# Altium schematic sheet WallLightRemote_V1.0_Displays.SchDoc: WallLight Remote
size A4; PageSetup: Record=PageOptions|CenterHorizontal=True|CenterVertical=True|PrintScale=0.97|XCorrection=1.00|YCorrection=1.00|PrintKind=0|BorderSize=5000000|LeftOffset=0|BottomOffset=0|Orientation=2|PaperLength=1000|PaperWidth=1000|Scale=100|PaperSource=7|PrintQuality=-3|MediaType=1|DitherType=10|PrintScaleMode=1|PaperKind=A4|PaperIndex=9; Organization: Crelin; Address1: Karl-Neuhaus-Strasse 6, 2502 Biel; Address2: Florian Baumgartner; Address3: florian.b-h@bluewin.ch; Address4: Tel: (+41) 32-323 56 25 / (+41) 79-502 92 10; DocumentNumber: Displays; Revision: V1.0; SheetNumber: 4; SheetTotal: 5; Author: Florian Baumgartner
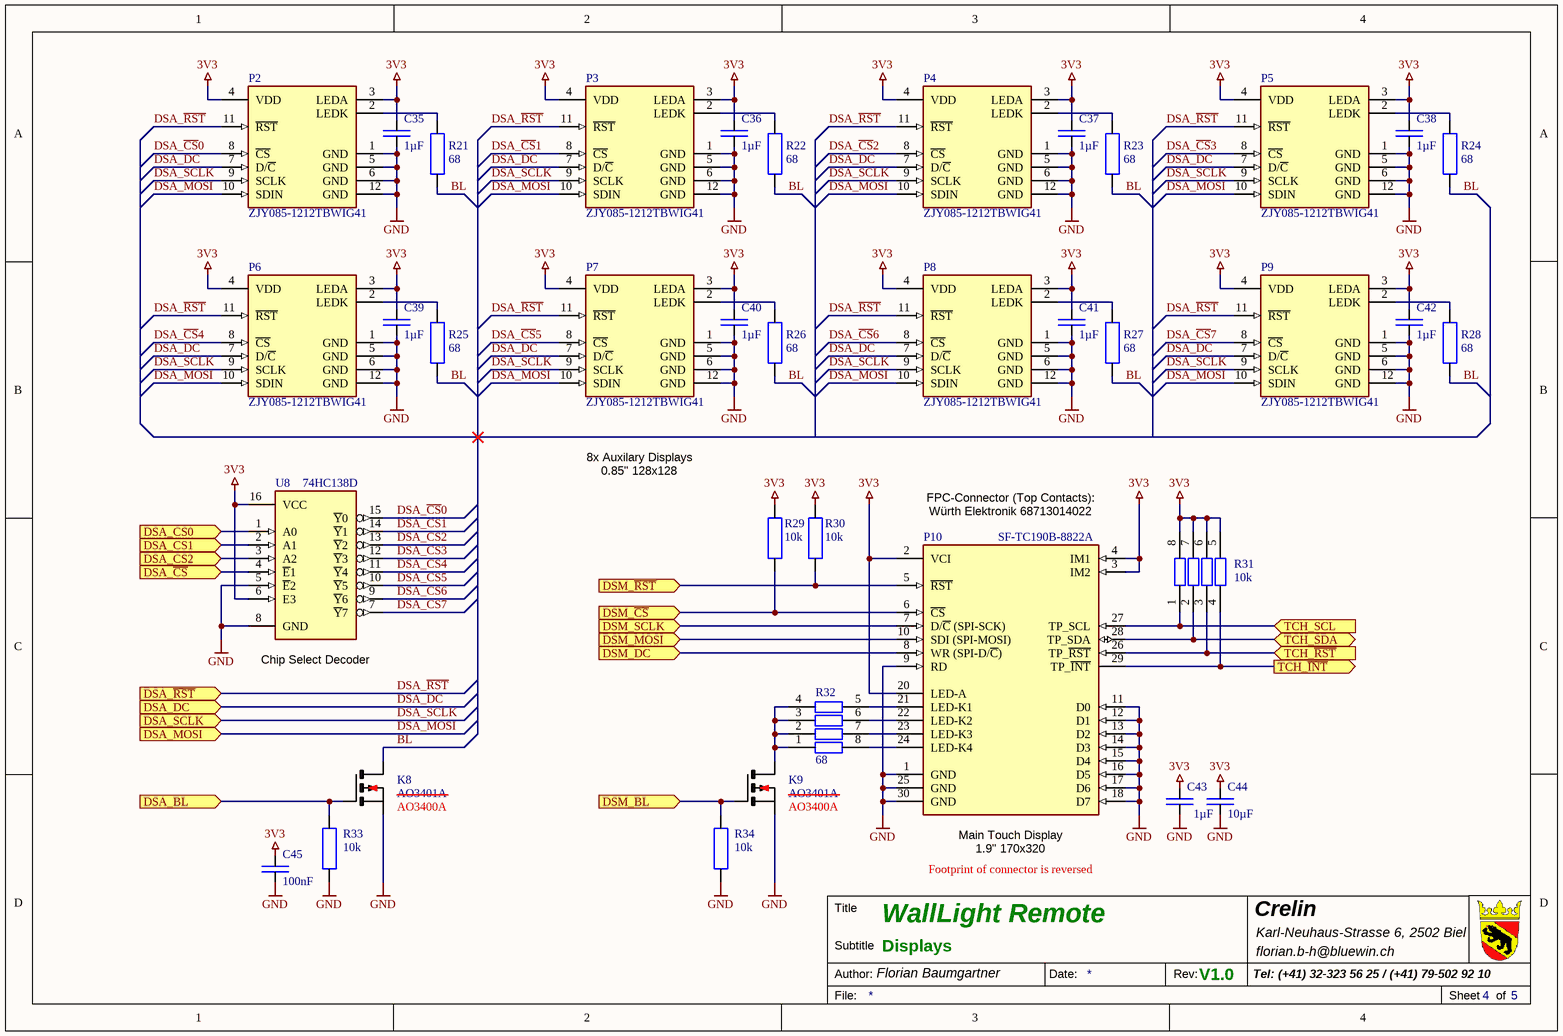
[diagram p0: WallLightRemote_V1.0_Displays.SchDoc]

## Parts
C35  1µF  [SMD Keramikkondensator 0603]
C36  1µF  [SMD Keramikkondensator 0603]
C37  1µF  [SMD Keramikkondensator 0603]
C38  1µF  [SMD Keramikkondensator 0603]
C39  1µF  [SMD Keramikkondensator 0603]
C40  1µF  [SMD Keramikkondensator 0603]
C41  1µF  [SMD Keramikkondensator 0603]
C42  1µF  [SMD Keramikkondensator 0603]
C43  1µF  [SMD Keramikkondensator 0603]
C44  10µF  [SMD Keramikkondensator 1206]
C45  100nF  [SMD Keramikkondensator 0603]
K8  AO3401A  [SMD MOSFET SOT-23]
K9  AO3401A  [SMD MOSFET SOT-23]
P2  ZJY085-1212TBWIG41  [SMD Display 0.85" (N085-1212TBWIG41)]
P3  ZJY085-1212TBWIG41  [SMD Display 0.85" (N085-1212TBWIG41)]
P4  ZJY085-1212TBWIG41  [SMD Display 0.85" (N085-1212TBWIG41)]
P5  ZJY085-1212TBWIG41  [SMD Display 0.85" (N085-1212TBWIG41)]
P6  ZJY085-1212TBWIG41  [SMD Display 0.85" (N085-1212TBWIG41)]
P7  ZJY085-1212TBWIG41  [SMD Display 0.85" (N085-1212TBWIG41)]
P8  ZJY085-1212TBWIG41  [SMD Display 0.85" (N085-1212TBWIG41)]
P9  ZJY085-1212TBWIG41  [SMD Display 0.85" (N085-1212TBWIG41)]
P10  SF-TC190B-8822A  [SMD Display 1.9" (SF-TC190B-8822A)]
R21  68  [SMD Widerstand 0603]
R22  68  [SMD Widerstand 0603]
R23  68  [SMD Widerstand 0603]
R24  68  [SMD Widerstand 0603]
R25  68  [SMD Widerstand 0603]
R26  68  [SMD Widerstand 0603]
R27  68  [SMD Widerstand 0603]
R28  68  [SMD Widerstand 0603]
R29  10k  [SMD Widerstand 0603]
R30  10k  [SMD Widerstand 0603]
R31  10k  [SMD Widerstand Array 4-Fach 0603]
R32  68  [SMD Widerstand Array 4-Fach 0603]
R33  10k  [SMD Widerstand 0603]
R34  10k  [SMD Widerstand 0603]
U8  74HC138D  [SMD IC SOIC-16]

## Ports
DSA_BL (in), DSA_CS0 (in), DSA_CS1 (in), DSA_CS2 (in), DSA_DC (in), DSA_MOSI (in), DSA_SCLK (in), DSA_~{CS} (in), DSA_~{RST} (in), DSM_BL (in), DSM_DC (in), DSM_MOSI (in), DSM_SCLK (in), DSM_~{CS} (in), DSM_~{RST} (in), TCH_SCL (in), TCH_SDA (bidir), TCH_~{INT} (out), TCH_~{RST} (in)

## Nets
3V3: C35.2 C36.2 C37.2 C38.2 C39.2 C40.2 C41.2 C42.2 C43.2 C44.2 C45.2 P2.3(LEDA) P2.4(VDD) P3.3(LEDA) P3.4(VDD) P4.3(LEDA) P4.4(VDD) P5.3(LEDA) P5.4(VDD) P6.3(LEDA) P6.4(VDD) P7.3(LEDA) P7.4(VDD) P8.3(LEDA) P8.4(VDD) P9.3(LEDA) P9.4(VDD) P10.2(VCI) P10.3(IM2) P10.4(IM1) P10.20(LED-A) R29.2 R30.2 R31.5 R31.6 R31.7 R31.8 U8.6(E3) U8.16(VCC)
GND: C35.1 C36.1 C37.1 C38.1 C39.1 C40.1 C41.1 C42.1 C43.1 C44.1 C45.1 K8.S K9.S P2.1(GND) P2.5(GND) P2.6(GND) P2.12(GND) P3.1(GND) P3.5(GND) P3.6(GND) P3.12(GND) P4.1(GND) P4.5(GND) P4.6(GND) P4.12(GND) P5.1(GND) P5.5(GND) P5.6(GND) P5.12(GND) P6.1(GND) P6.5(GND) P6.6(GND) P6.12(GND) P7.1(GND) P7.5(GND) P7.6(GND) P7.12(GND) P8.1(GND) P8.5(GND) P8.6(GND) P8.12(GND) P9.1(GND) P9.5(GND) P9.6(GND) P9.12(GND) P10.1(GND) P10.9(RD) P10.11(D0) P10.12(D1) P10.13(D2) P10.14(D3) P10.15(D4) P10.16(D5) P10.17(D6) P10.18(D7) P10.25(GND) P10.30(GND) R33.1 R34.1 U8.5(~{E}2) U8.8(GND)
BL: K8.D R21.2 R22.2 R23.2 R24.2 R25.2 R26.2 R27.2 R28.2
DSA_BL: K8.G R33.2 ; port DSA_BL
DSA_~{CS}: U8.4(~{E}1) ; port DSA_~{CS}
DSA_~{CS}0: P2.8(~{CS}) U8.15(~{Y}0)
DSA_~{CS}1: P3.8(~{CS}) U8.14(~{Y}1)
DSA_~{CS}2: P4.8(~{CS}) U8.13(~{Y}2)
DSA_~{CS}3: P5.8(~{CS}) U8.12(~{Y}3)
DSA_~{CS}4: P6.8(~{CS}) U8.11(~{Y}4)
DSA_~{CS}5: P7.8(~{CS}) U8.10(~{Y}5)
DSA_~{CS}6: P8.8(~{CS}) U8.9(~{Y}6)
DSA_~{CS}7: P9.8(~{CS}) U8.7(~{Y}7)
DSA_CS0: U8.1(A0) ; port DSA_CS0
DSA_CS1: U8.2(A1) ; port DSA_CS1
DSA_CS2: U8.3(A2) ; port DSA_CS2
DSA_DC: P2.7(D/~{C}) P3.7(D/~{C}) P4.7(D/~{C}) P5.7(D/~{C}) P6.7(D/~{C}) P7.7(D/~{C}) P8.7(D/~{C}) P9.7(D/~{C}) ; port DSA_DC
DSA_MOSI: P2.10(SDIN) P3.10(SDIN) P4.10(SDIN) P5.10(SDIN) P6.10(SDIN) P7.10(SDIN) P8.10(SDIN) P9.10(SDIN) ; port DSA_MOSI
DSA_~{RST}: P2.11(~{RST}) P3.11(~{RST}) P4.11(~{RST}) P5.11(~{RST}) P6.11(~{RST}) P7.11(~{RST}) P8.11(~{RST}) P9.11(~{RST}) ; port DSA_~{RST}
DSA_SCLK: P2.9(SCLK) P3.9(SCLK) P4.9(SCLK) P5.9(SCLK) P6.9(SCLK) P7.9(SCLK) P8.9(SCLK) P9.9(SCLK) ; port DSA_SCLK
DSM_BL: K9.G R34.2 ; port DSM_BL
DSM_~{CS}: P10.6(~{CS}) R29.1 ; port DSM_~{CS}
DSM_DC: P10.8(WR_(SPI-D/~{C})) ; port DSM_DC
DSM_MOSI: P10.10(SDI_(SPI-MOSI)) ; port DSM_MOSI
DSM_~{RST}: P10.5(~{RST}) R30.1 ; port DSM_~{RST}
DSM_SCLK: P10.7(D/~{C}_(SPI-SCK)) ; port DSM_SCLK
TCH_~{INT}: P10.29(TP_~{INT}) R31.4 ; port TCH_~{INT}
TCH_~{RST}: P10.26(TP_~{RST}) R31.3 ; port TCH_~{RST}
TCH_SCL: P10.27(TP_SCL) R31.1 ; port TCH_SCL
TCH_SDA: P10.28(TP_SDA) R31.2 ; port TCH_SDA
NetK9_D: K9.D R32.1 R32.2 R32.3 R32.4
NetP2_2: P2.2(LEDK) R21.1
NetP3_2: P3.2(LEDK) R22.1
NetP4_2: P4.2(LEDK) R23.1
NetP5_2: P5.2(LEDK) R24.1
NetP6_2: P6.2(LEDK) R25.1
NetP7_2: P7.2(LEDK) R26.1
NetP8_2: P8.2(LEDK) R27.1
NetP9_2: P9.2(LEDK) R28.1
NetP10_21: P10.21(LED-K1) R32.5
NetP10_22: P10.22(LED-K2) R32.6
NetP10_23: P10.23(LED-K3) R32.7
NetP10_24: P10.24(LED-K4) R32.8

Not connected (* = marked no-connect by the designer): P10 19(NC)

## Notes on the sheet
- 8x Auxilary Displays
- 0.85" 128x128
- FPC-Connector (Top Contacts):
- (near P10) Würth Elektronik 68713014022
- (near U8) Chip Select Decoder
- (near K8) AO3400A
- (near K9) AO3400A
- (near P10) Main Touch Display
- (near P10) 1.9" 170x320
- Footprint of connector is reversed
- Title
- Crelin
- Author:
- Subtitle
- Date:
- Rev:
- File:
- Sheet
- of

## Library data of the parts
C35-C43 = C-CAPACITOR: CAP-MK; Component Description: Multilayer Ceramic Capacitors; Component Value: 1µF 50V; Digikey: 1276-1860-1-ND; Farnell: 3013383; Mouser: 187-CL10A105KB8NNNC; JLC-Parts: C15849; Unit Price: 0.01
C44 = E6 - 10uF: SMD Ceramic Capacitor E6; Component Value: 10µF 50V; Component Description: Multilayer Ceramic Capacitors MLCC; ComponentLink1Description: Datasheet; ComponentLink1URL: https://datasheet.lcsc.com/lcsc/1810191219_Samsung-Electro-Mechanics-CL10A106KP8NNNC_C19702.pdf; Digikey: 587-3258-1-ND; Farnell: 2113070; JLC-Parts: C13585; Mouser: 963-LMK107BBJ106MALT; Unit Price: 0.01
C45 = E6 - 100nF: SMD Ceramic Capacitor E6; Component Value: 100nF 50V; Component Description: Multilayer Ceramic Capacitors MLCC; ComponentLink1Description: Datasheet; ComponentLink1URL: https://datasheet.lcsc.com/lcsc/1809301912_YAGEO-CC0603KRX7R9BB104_C14663.pdf; Digikey: 445-6899-1-ND; Farnell: 2210822; JLC-Parts: C14663; Mouser: 810-CGA2B3X7R1H104K; Unit Price: 0.01
K8 K9 = K-FET:PIGE: MOSFET P-Channel; Digikey: 785-1001-1-ND; Component Description: MOSFET P-Channel; ComponentLink1Description: Datasheet; ComponentLink1URL: https://datasheet.lcsc.com/lcsc/1810171817_Alpha---Omega-Semicon-AO3401A_C15127.pdf; Component Value: AO3401A; JLC-Parts: C15127; Unit Price: 0.14
P2-P9 = P-ZJY085-1212TBWIG41: TFT-LCD 0.85" 128x128; AliExpress: 1005004490846551; ComponentLink1Description: Datasheet; ComponentLink1URL: https://cdn.hackaday.io/files/1881838051221472/SPEC%20ZJY085-1212TBWIG41.pdf; Component Description: TFT-LCD 0.85" 128x128; Component Value: ZJY085-1212TBWIG41; Unit Price: 1.85
P10 = P-SF-TC190B-8822A: TFT-LCD 1.9" 170x320; ComponentLink1Description: Datasheet; ComponentLink1URL: https://www.midasdisplays.com/getattachment/8f320ce8-2a9c-403e-8681-7aa934dd4afb/specification; Component Description: TFT-LCD 1.9" 170x320; Component Value: SF-TC190B-8822A; Unit Price: 4.20
R21-R28 = R-RESISTOR: SMD-Widerstand 1/4W; Component Description: Thick Film Chip Resistor; Component Value: 68 (75V, 100mW, 1%); Digikey: P680HCT-ND; Farnell: 2303131; Mouser: 667-ERJ-3EKF6800V; JLC-Parts: C27592; Unit Price: 0.01
R29 R30 R33 R34 = R-RESISTOR: RES (E=Heizwiderstand B=Messwandler); Component Description: Thick Film Chip Resistor; Component Value: 10k (75V, 100mW, 1%); Digikey: P10.0KHCT-ND; Farnell: 2303192; Mouser: 667-ERJ-3EKF1002V; JLC-Parts: C25804; Unit Price: 0.01
R31 = R-Array Single Quad E24 - 10k: Isolated Resistor Array; Component Value: 10k (4x, 50V, 62.5mW, 5%); ComponentLink1Description: Datasheet; ComponentLink1URL: https://datasheet.lcsc.com/lcsc/1810191515_UNI-ROYAL-Uniroyal-Elec-4D03WGJ0103T5E_C29718.pdf; Digikey: Y4103CT-ND; Farnell: 2060167; JLC-Parts: C29718; Mouser: 667-EXB-V8V103JV; Unit Price: 0.01; Component Description: Isolated Resistor Array
R32 = R-Array Single Quad E24 - 10k: Isolated Resistor Array; Component Value: 68 (4x, 50V, 62.5mW, 5%); ComponentLink1Description: Datasheet; ComponentLink1URL: https://datasheet.lcsc.com/lcsc/1810191515_UNI-ROYAL-Uniroyal-Elec-4D03WGJ0103T5E_C29718.pdf; Digikey: Y4680CT-ND; Farnell: 2060156; JLC-Parts: C25513; Mouser: 667-EXB-V8V680JV; Unit Price: 0.01; Component Description: Isolated Resistor Array
U8 = U-74HC138D: 3-to-8 Line Decoder (Inverting); ComponentLink1Description: Datasheet; ComponentLink1URL: https://datasheet.lcsc.com/lcsc/2211081800_JSMSEMI-74HC138D_C5205140.pdf; Digikey: 1727-2781-1-ND; Component Value: 74HC138D; Farnell: 1201320; JLC-Parts: C5205140; Mouser: 771-74HC138D-T; Unit Price: 0.10; Component Description: 3-to-8 Line Decoder (Inverting)